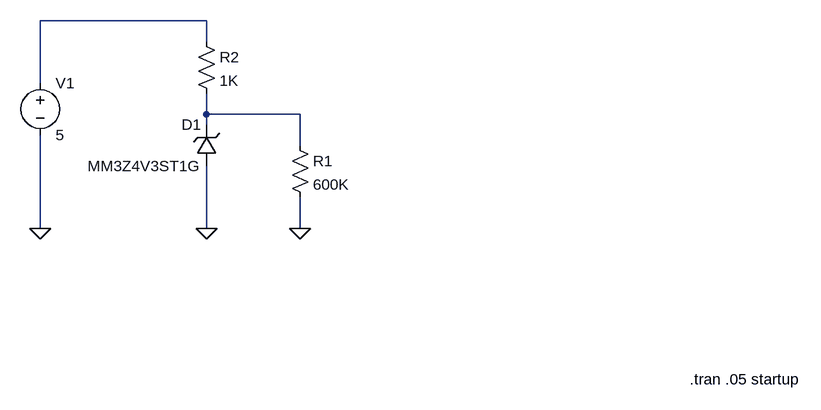
[diagram p0: schematic zener.asc]
zener.asc, the LTspice schematic file:
Version 4
SHEET 1 1136 680
WIRE 208 112 -48 112
WIRE 208 144 208 112
WIRE -48 208 -48 112
WIRE 208 256 208 224
WIRE 352 256 208 256
WIRE 208 272 208 256
WIRE 352 304 352 256
WIRE -48 432 -48 288
WIRE 208 432 208 336
WIRE 352 432 352 384
FLAG -48 432 0
FLAG 208 432 0
FLAG 352 432 0
SYMBOL zener 224 336 R180
WINDOW 0 24 64 Left 2
WINDOW 3 24 0 Left 2
SYMATTR InstName D1
SYMATTR Value MM3Z4V3ST1G
SYMBOL voltage -48 192 R0
SYMATTR InstName V1
SYMATTR Value 5
SYMATTR SpiceLine Rser=0
SYMBOL res 336 288 R0
SYMATTR InstName R1
SYMATTR Value 600K
SYMBOL res 192 128 R0
SYMATTR InstName R2
SYMATTR Value 1K
TEXT 952 664 Left 2 !.tran .05 startup

The netlist it stands for:
* zener.asc
D1 0 N002 MM3Z4V3ST1G
V1 N001 0 5 Rser=0
R1 N002 0 600K
R2 N001 N002 1K
.model D D
.lib standard.dio
.tran .05 startup
.backanno
.end